# Altium schematic sheet [3]-Connection.SchDoc
size A4
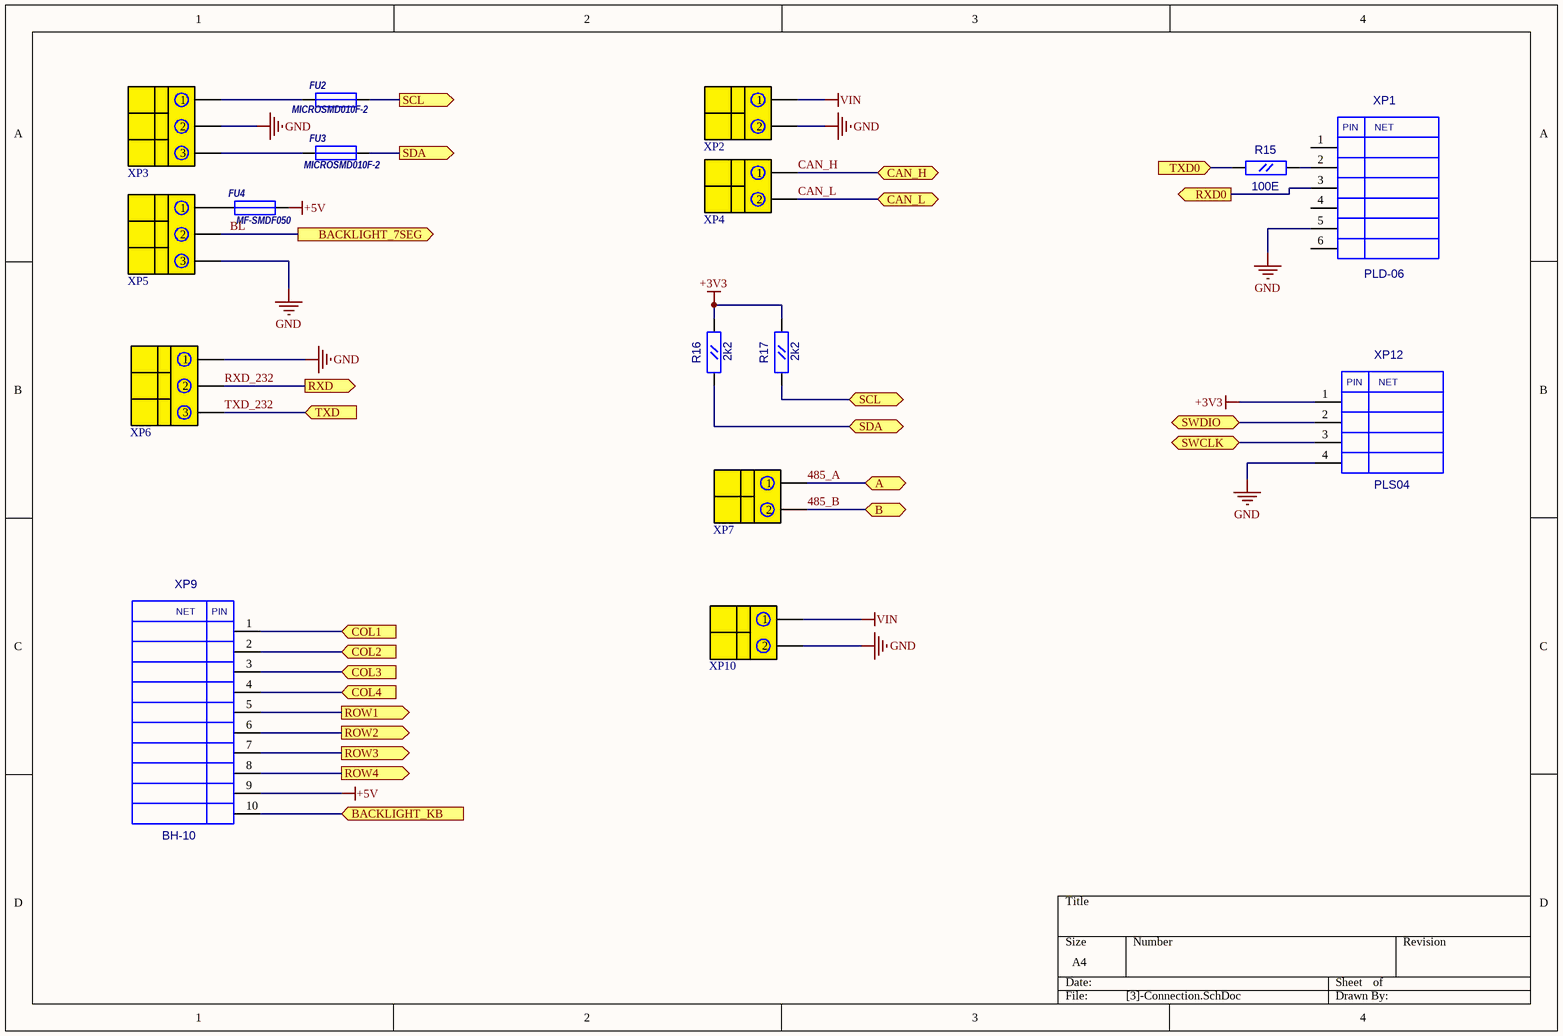
[diagram p0: [3]-Connection.SchDoc]

## Parts
FU2  MICROSMD010F-2  [RC1210]
FU3  MICROSMD010F-2  [RC1210]
FU4  MF-SMDF050  [MF-SMDF]
R15  100E  [RC0603]
R16  2k2  [RC0603]
R17  2k2  [RC0603]
XP1  PLD-06  [PIN6]
XP2  DG330-2PIN  [DG330-2PIN]  (value not drawn)
XP3  DG330-3PIN  [DG330-3PIN]  (value not drawn)
XP4  DG330-2PIN  [DG330-2PIN]  (value not drawn)
XP5  DG330-3PIN  [DG330-3PIN]  (value not drawn)
XP6  DG330-3P  [DG330-3PIN]  (value not drawn)
XP7  DG330-2PIN  [DG330-2PIN]  (value not drawn)
XP9  BH-10  [BH-10]
XP10  DG330-2PIN  [DG330-2PIN]  (value not drawn)
XP12  PLS04  [PIN04S]

## Ports
A (bidir), B (bidir), BACKLIGHT_7SEG (out), BACKLIGHT_KB (in), CAN_H (bidir), CAN_L (bidir), COL1 (in), COL2 (in), COL3 (in), COL4 (in), ROW1 (out), ROW2 (out), ROW3 (out), ROW4 (out), RXD0 (out), RXD (out), SCL (bidir), SCL (out), SDA (bidir), SDA (out), SWCLK (bidir), SWDIO (bidir), TXD0 (in), TXD (in)

## Nets
+3V3: R16.2(B) R17.2(B) XP12.1
+5V: FU4.2 XP9.9
GND: XP1.5 XP2.2 XP3.2 XP5.3 XP6.1 XP10.2 XP12.4
VIN: XP2.1 XP10.1
485_A: XP7.1 ; port A
485_B: XP7.2 ; port B
BACKLIGHT_KB: XP9.10 ; port BACKLIGHT_KB
BL: XP5.2 ; port BACKLIGHT_7SEG
CAN_H: XP4.1 ; port CAN_H
CAN_L: XP4.2 ; port CAN_L
COL1: XP9.1 ; port COL1
COL2: XP9.2 ; port COL2
COL3: XP9.3 ; port COL3
COL4: XP9.4 ; port COL4
ROW1: XP9.5 ; port ROW1
ROW2: XP9.6 ; port ROW2
ROW3: XP9.7 ; port ROW3
ROW4: XP9.8 ; port ROW4
RXD0: XP1.3 ; port RXD0
RXD_232: XP6.2 ; port RXD
SCL: FU2.2 R17.1(A) ; port SCL
SDA: FU3.2 R16.1(A) ; port SDA
SWCLK: XP12.3 ; port SWCLK
SWDIO: XP12.2 ; port SWDIO
TXD0: R15.1(A) ; port TXD0
TXD_232: XP6.3 ; port TXD
NetFU2_1: FU2.1 XP3.1
NetFU3_1: FU3.1 XP3.3
NetFU4_1: FU4.1 XP5.1
NetR15_2: R15.2(B) XP1.2

Not connected (* = marked no-connect by the designer): XP1 1 4 6

## Notes on the sheet
- (in symbol BH-10) NET; PIN
- (in symbol PLD-06) PIN; NET
- (in symbol PLS04) PIN; NET

## Library data of the parts
FU2 FU3 = MICROSMD: Value: MICROSMD010F-2
FU4 = MF-SMDF: Value: MF-SMDF050
R15-R17 = RC0603
  R15: Value: 100E
  R16 R17: Value: 2k2
XP1 = PLD-06: PLD06; Value: *
XP6 = DG330-3PIN: Value: DG330-3P
XP2 XP4 XP7 XP10 = DG330-2PIN: Value: DG330-2PIN
XP3 XP5 = DG330-3PIN: Value: DG330-3PIN
XP9 = BH-10: Value: *
XP12 = PLS04: Value: *